# Altium schematic sheet MainBoard_Schematic.SchDoc
size A4
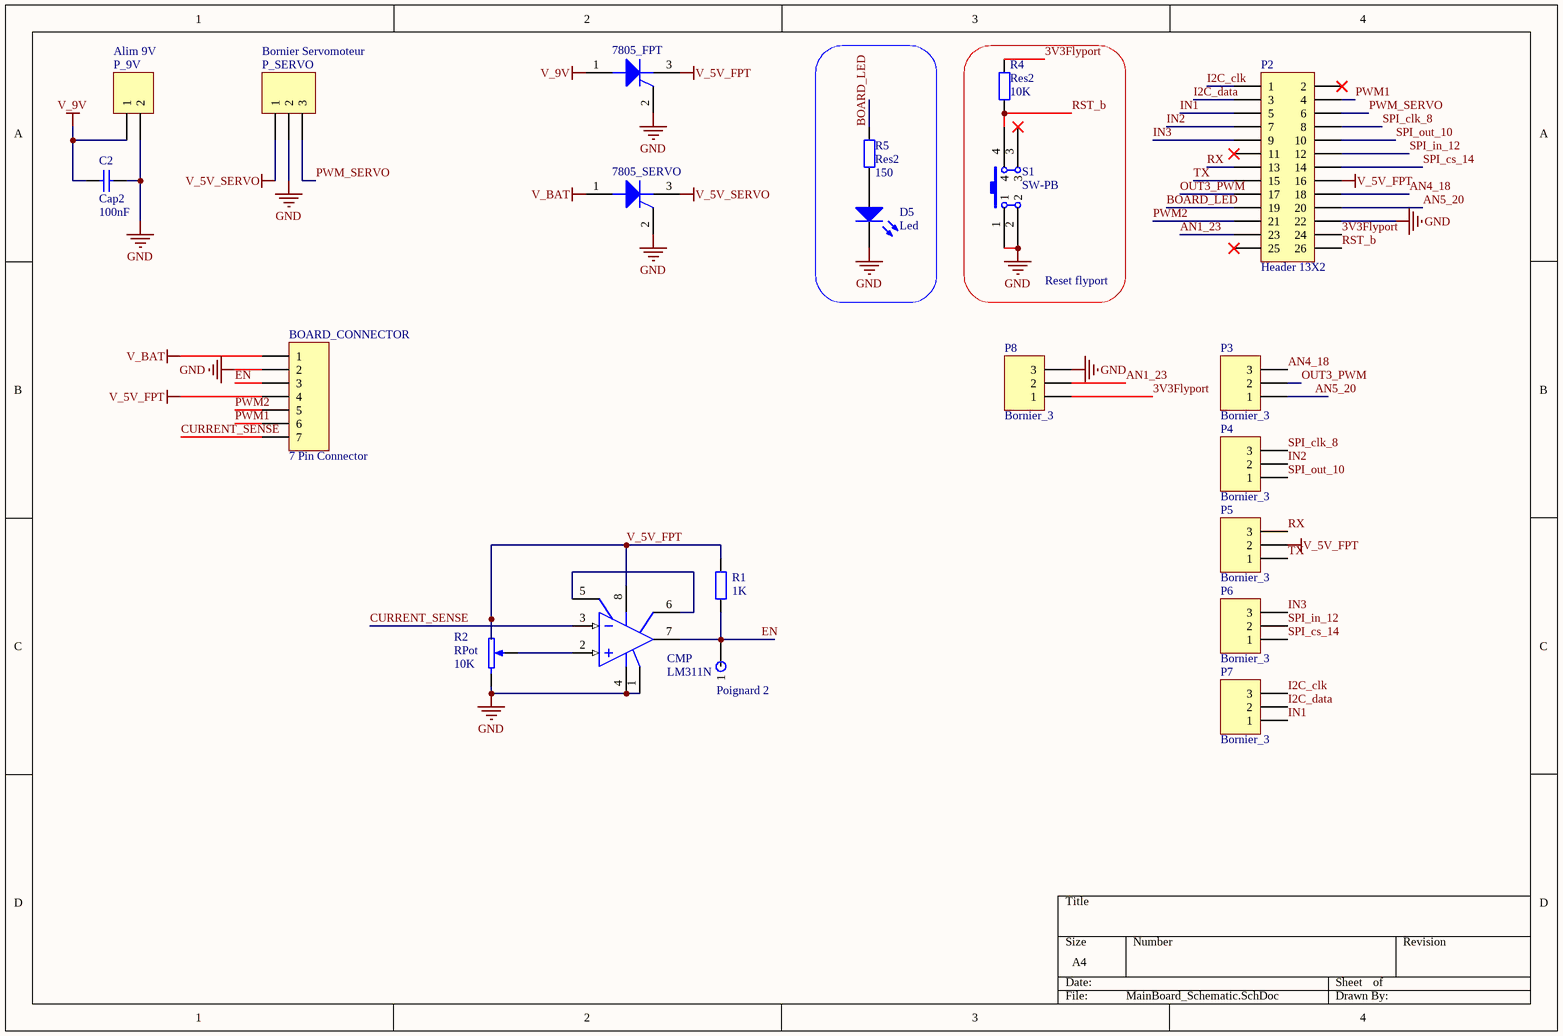
[diagram p0: MainBoard_Schematic.SchDoc]

## Parts
7805_FPT  SCR  [TO-220-AB]  (value not drawn)
7805_SERVO  SCR  [TO-220-AB]  (value not drawn)
BOARD_CONNECTOR  7 Pin Connector  [HDR1X7]
C2  Cap2  value 100nF  [CAPA2]
CMP  LM311N  [DIP8]
D5  Led  [LED]
P2  Header 13X2  [HDR2X13]
P3  Bornier_3  [Bornier_3]
P4  Bornier_3  [Bornier_3]
P5  Bornier_3  [Bornier_3]
P6  Bornier_3  [Bornier_3]
P7  Bornier_3  [Bornier_3]
P8  Bornier_3  [Bornier_3]
P_9V  Alim 9V  [Bornier_2]
P_SERVO  Bornier Servomoteur  [Bornier_3]
Poignard_2  Poignard  [Poignard]  (value not drawn)
R1  value 1K  [res5_1/4W]  (hidden comment: Res2)
R2  RPot  value 10K  [AJUSTABLE]
R4  Res2  value 10K  [res5_1/4W]
R5  Res2  value 150  [res5_1/4W]
S1  SW-PB  [SW_BP]

## Blocks framed on the sheet
Reset flyport: R4 S1

## Nets
GND: 7805_FPT.2(GND) 7805_SERVO.2(GND) BOARD_CONNECTOR.2 C2.2 CMP.1(GND) CMP.4(V-_(CASE)) D5.2(K) P2.22 P8.3 P_9V.2 P_SERVO.2 R2.3(TOP) S1.1 S1.2
V_5V_FPT: 7805_FPT.3(OUT) BOARD_CONNECTOR.4 CMP.8(V+) P2.16 P5.2 R1.2 R2.1(BOT)
V_5V_SERVO: 7805_SERVO.3(OUT) P_SERVO.1
V_9V: 7805_FPT.1(IN) C2.1 P_9V.1
V_BAT: 7805_SERVO.1(IN) BOARD_CONNECTOR.1
3V3Flyport: P2.24 P8.1 R4.1
AN1_23: P2.23 P8.2
AN4_18: P2.18 P3.3
AN5_20: P2.20 P3.1
BOARD_LED: P2.19 R5.1
CURRENT_SENSE: BOARD_CONNECTOR.7 CMP.3(IN-)
EN: BOARD_CONNECTOR.3 CMP.7(OUT) Poignard_2.1 R1.1
I2C_clk: P2.1 P7.3
I2C_data: P2.3 P7.2
IN1: P2.5 P7.1
IN2: P2.7 P4.2
IN3: P2.9 P6.3
OUT3_PWM: P2.17 P3.2
PWM1: BOARD_CONNECTOR.6 P2.4
PWM2: BOARD_CONNECTOR.5 P2.21
PWM_SERVO: P2.6 P_SERVO.3
RST_b: P2.26 R4.2 S1.4
RX: P2.13 P5.3
SPI_clk_8: P2.8 P4.3
SPI_cs_14: P2.14 P6.1
SPI_in_12: P2.12 P6.2
SPI_out_10: P2.10 P4.1
TX: P2.15 P5.1
NetCMP_2: CMP.2(IN+) R2.2(TAP)
NetCMP_5: CMP.5(BAL) CMP.6(BAL/STB)
NetD5_1: D5.1(A) R5.2

Not connected (* = marked no-connect by the designer): P2 2* 11* 25*; S1 3*

## Library data of the parts
7805_FPT 7805_SERVO = SCR: Silicon Controlled Rectifier; Published: 8-Jun-2000; LatestRevisionDate: 17-Jul-2002; LatestRevisionNote: Re-released for DXP Platform.; PackageReference: TO-220-AB; Publisher: Altium Limited; Code_JEDEC: TO-220-AB
BOARD_CONNECTOR = Header 7: Header, 7-Pin; LatestRevisionDate: 17-Jul-2002; LatestRevisionNote: Re-released for DXP Platform.; Publisher: Altium Limited
C2 = Cap2: Capacitor; Published: 8-Jun-2000; LatestRevisionDate: 17-Jul-2002; LatestRevisionNote: Re-released for DXP Platform.; PackageReference: RAD-0.3; Publisher: Altium Limited
CMP = LM311N: Voltage Comparator; Published: 24-Aug-2001; LatestRevisionDate: 06-Jun-2005; LatestRevisionNote: Stylized 3D Model Added.; DatasheetVersion: Oct-1997; PackageReference: DIP8; Publisher: Altium Limited; PackageDescription: DIP; 8 Leads; Row Spacing 7.62 mm; Pitch 2.54 mm; Code_JEDEC: MO-001-AN; ComponentLink1Description: Manufacturer Link; ComponentLink1URL: http://www.st.com/; ComponentLink2Description: Datasheet; ComponentLink2URL: http://www.st.com/stonline/products/literature/ds/4848/lm211.pdf
P2 = Header 13X2: Header, 13-Pin, Dual row; LatestRevisionDate: 17-Jul-2002; LatestRevisionNote: Re-released for DXP Platform.; Publisher: Altium Limited
P3-P8 P_SERVO = Bornier_3: Header, 3-Pin; LatestRevisionDate: 17-Jul-2002; LatestRevisionNote: Re-released for DXP Platform.; Publisher: Altium Limited
P_9V = Bornier_2: Header, 2-Pin; LatestRevisionDate: 17-Jul-2002; LatestRevisionNote: Re-released for DXP Platform.; Publisher: Altium Limited
R1 R4 R5 = Res2: Resistor; Published: 8-Jun-2000; LatestRevisionDate: 17-Jul-2002; LatestRevisionNote: Re-released for DXP Platform.; PackageReference: AXIAL-0.4; Publisher: Altium Limited
R2 = RPot: Potentiometer; Sim Note: Enter the Resistance value and the set point into parameter fields.; Set Position: 0.5; Published: 8-Jun-2000; LatestRevisionDate: 17-Jul-2002; LatestRevisionNote: Re-released for DXP Platform.; PackageReference: VR5; Publisher: Altium Limited
S1 = SW-PB: Switch; Published: 24-Mar-1999; LatestRevisionDate: 17-Jul-2002; LatestRevisionNote: Re-released for DXP Platform.; PackageReference: SPST-2; Publisher: Altium Limited
D5 = Led: Published: 8-Jun-2000; LatestRevisionDate: 17-Jul-2002; LatestRevisionNote: Re-released for DXP Platform.; DatasheetDocument: 1998; PackageDocument: Aug-1999; PackageReference: DO-41; Publisher: Altium Limited; Code_JEDEC: DO-204-AL; ComponentLink1Description: Manufacturer Link; ComponentLink1URL: http://www.fairchildsemi.com/; ComponentLink2Description: Datasheet; ComponentLink2URL: http://www.fairchildsemi.com/ds/1N%2F1N4001.pdf
Poignard_2 = Poignard: LatestRevisionDate: 17-Jul-2002; LatestRevisionNote: Re-released for DXP Platform.; Publisher: Altium Limited